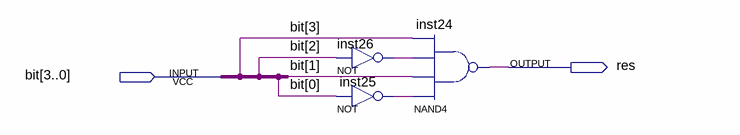
[diagram p0: schematic sheet]
// Quartus schematic verify_end_game.bdf as structural Verilog: 3 symbols, 2 pins
module verify_end_game (
  input  [3:0] \bit ,
  output res
);

  wire inst25_out, inst26_out;

  not inst26 (inst26_out, \bit [2]);
  not inst25 (inst25_out, \bit [0]);
  nand inst24 (res, inst25_out, \bit [1], inst26_out, \bit [3]);
endmodule
